# Altium schematic sheet LCD&Joystick.SchDoc
size A4; Revision: B.1(PCB.SCH)
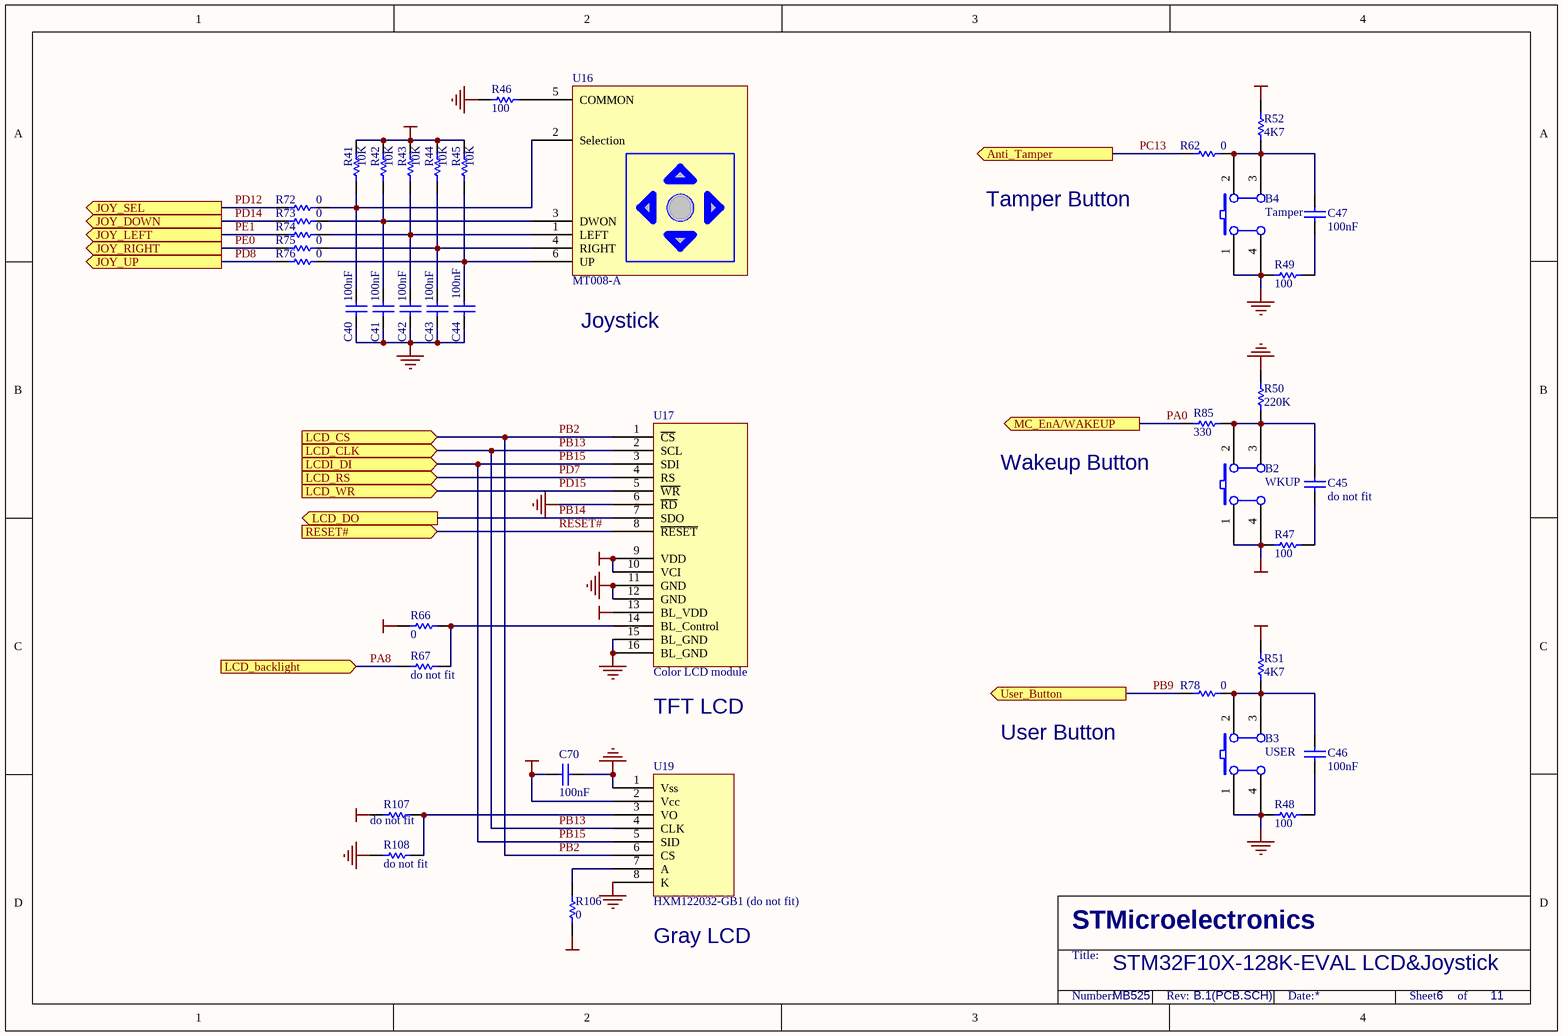
[diagram p0: LCD&Joystick.SchDoc]

## Parts
B2  WKUP  [PB10]
B3  USER  [PB10]
B4  Tamper  [PB10]
C40  100nF  [0603P]
C41  100nF  [0603P]
C42  100nF  [0603P]
C43  100nF  [0603P]
C44  100nF  [0603P]
C45  do not fit  [0603P]
C46  100nF  [0603P]
C47  100nF  [0603P]
C70  100nF  [0603P]
R41  10K  [0603]
R42  10K  [0603]
R43  10K  [0603]
R44  10K  [0603]
R45  10K  [0603]
R46  100  [0603]
R47  100  [0603]
R48  100  [0603]
R49  100  [0603]
R50  220K  [0603]
R51  4K7  [0603]
R52  4K7  [0603]
R62  0  [0805]
R66  0  [0603]
R67  do not fit  [0603]
R72  0  [0805]
R73  0  [0805]
R74  0  [0805]
R75  0  [0805]
R76  0  [0805]
R78  0  [0805]
R85  330  [0805]
R106  0  [0603]
R107  do not fit  [0603]
R108  do not fit  [0603]
U16  MT008-A  [JOY]
U17  Color LCD module  [AM240320A]
U19  HXM122032-GB1 (do not fit)  [LCD12232-GB1]

## Ports
Anti_Tamper (out), JOY_DOWN (out), JOY_LEFT (out), JOY_RIGHT (out), JOY_SEL (out), JOY_UP (out), LCD_backlight (in), LCD_CLK (in), LCD_CS (in), LCD_DO (out), LCD_RS (in), LCD_WR (in), LCDI_DI (in), MC_EnA/WAKEUP (out), RESET# (in), User_Button (out)

## Nets
+3V3: B2.1(A0) B2.4(A1) C70.1 R41.1 R42.2 R43.2 R44.2 R45.2 R47.1 R51.2 R52.2 R66.2 R107.2 U17.9(VDD) U17.10(VCI) U17.13(BL_VDD) U19.2(Vcc)
+5V: R106.1
GND: B3.1(A0) B3.4(A1) B4.1(A0) B4.4(A1) C40.1 C41.1 C42.1 C43.1 C44.1 C70.2 R46.1 R48.1 R49.1 R50.2 R108.1 U17.6(~{RD}) U17.11(GND) U17.12(GND) U17.15(BL_GND) U17.16(BL_GND) U19.1(Vss) U19.8(K)
PA0: R85.2 ; port MC_EnA/WAKEUP
PA8: R67.1 ; port LCD_backlight
PB2: U17.1(~{CS}) U19.6(CS) ; port LCD_CS
PB9: R78.2 ; port User_Button
PB13: U17.2(SCL) U19.4(CLK) ; port LCD_CLK
PB14: U17.7(SDO) ; port LCD_DO
PB15: U17.3(SDI) U19.5(SID) ; port LCDI_DI
PC13: R62.2 ; port Anti_Tamper
PD7: U17.4(RS) ; port LCD_RS
PD8: R76.2 ; port JOY_UP
PD12: R72.2 ; port JOY_SEL
PD14: R73.2 ; port JOY_DOWN
PD15: U17.5(~{WR}) ; port LCD_WR
PE0: R75.2 ; port JOY_RIGHT
PE1: R74.2 ; port JOY_LEFT
RESET#: U17.8(~{RESET}) ; port RESET#
NetB2_2: B2.2(B0) B2.3(B1) C45.2 R50.1 R85.1
NetB3_2: B3.2(B0) B3.3(B1) C46.2 R51.1 R78.1
NetB4_2: B4.2(B0) B4.3(B1) C47.2 R52.1 R62.1
NetC40_2: C40.2 R41.2 R72.1 U16.2(Selection)
NetC41_2: C41.2 R42.1 R73.1 U16.3(DWON)
NetC42_2: C42.2 R43.1 R74.1 U16.1(LEFT)
NetC43_2: C43.2 R44.1 R75.1 U16.4(RIGHT)
NetC44_2: C44.2 R45.1 R76.1 U16.6(UP)
NetC45_1: C45.1 R47.2
NetC46_1: C46.1 R48.2
NetC47_1: C47.1 R49.2
NetR46_2: R46.2 U16.5(COMMON)
NetR66_1: R66.1 R67.2 U17.14(BL_Control)
NetR106_2: R106.2 U19.7(A)
NetR107_1: R107.1 R108.2 U19.3(VO)

## Notes on the sheet
- Tamper Button
- (near U16) Joystick
- Wakeup Button
- TFT LCD
- User Button
- (near U19) Gray LCD
- STM32F10X-128K-EVAL LCD&Joystick
- MB525
- 6
- 11
- STMicroelectronics
- Title:
- Number:
- Rev:
- Date:
- Sheet       of

## Library data of the parts
B2-B4 = SW PUSHBUTTON: SE PUSHBUTTON
C40-C47 C70 = CAP: Capacitor; Value: 100pF; Published: 8-Jun-2000; Revision: July-2002: Re-released for DXP Platform.; Publisher: Altium Limited
R41-R49 R62 R66 R67 R72-R76 R78 R85 R106-R108 = Res1: Resistor; Value: 1K; Published: 8-Jun-2000; Revision: July-2002: Re-released for DXP Platform.; Publisher: Altium Limited
R50-R52 = res1: Resistor; Value: 1K; Published: 8-Jun-2000; Revision: July-2002: Re-released for DXP Platform.; Publisher: Altium Limited
U16 = MT-008A
U17 = ColorLCD_module
U19 = HXM122032-GB1